# EAGLE design M5921A (EAGLE 6.6.0)
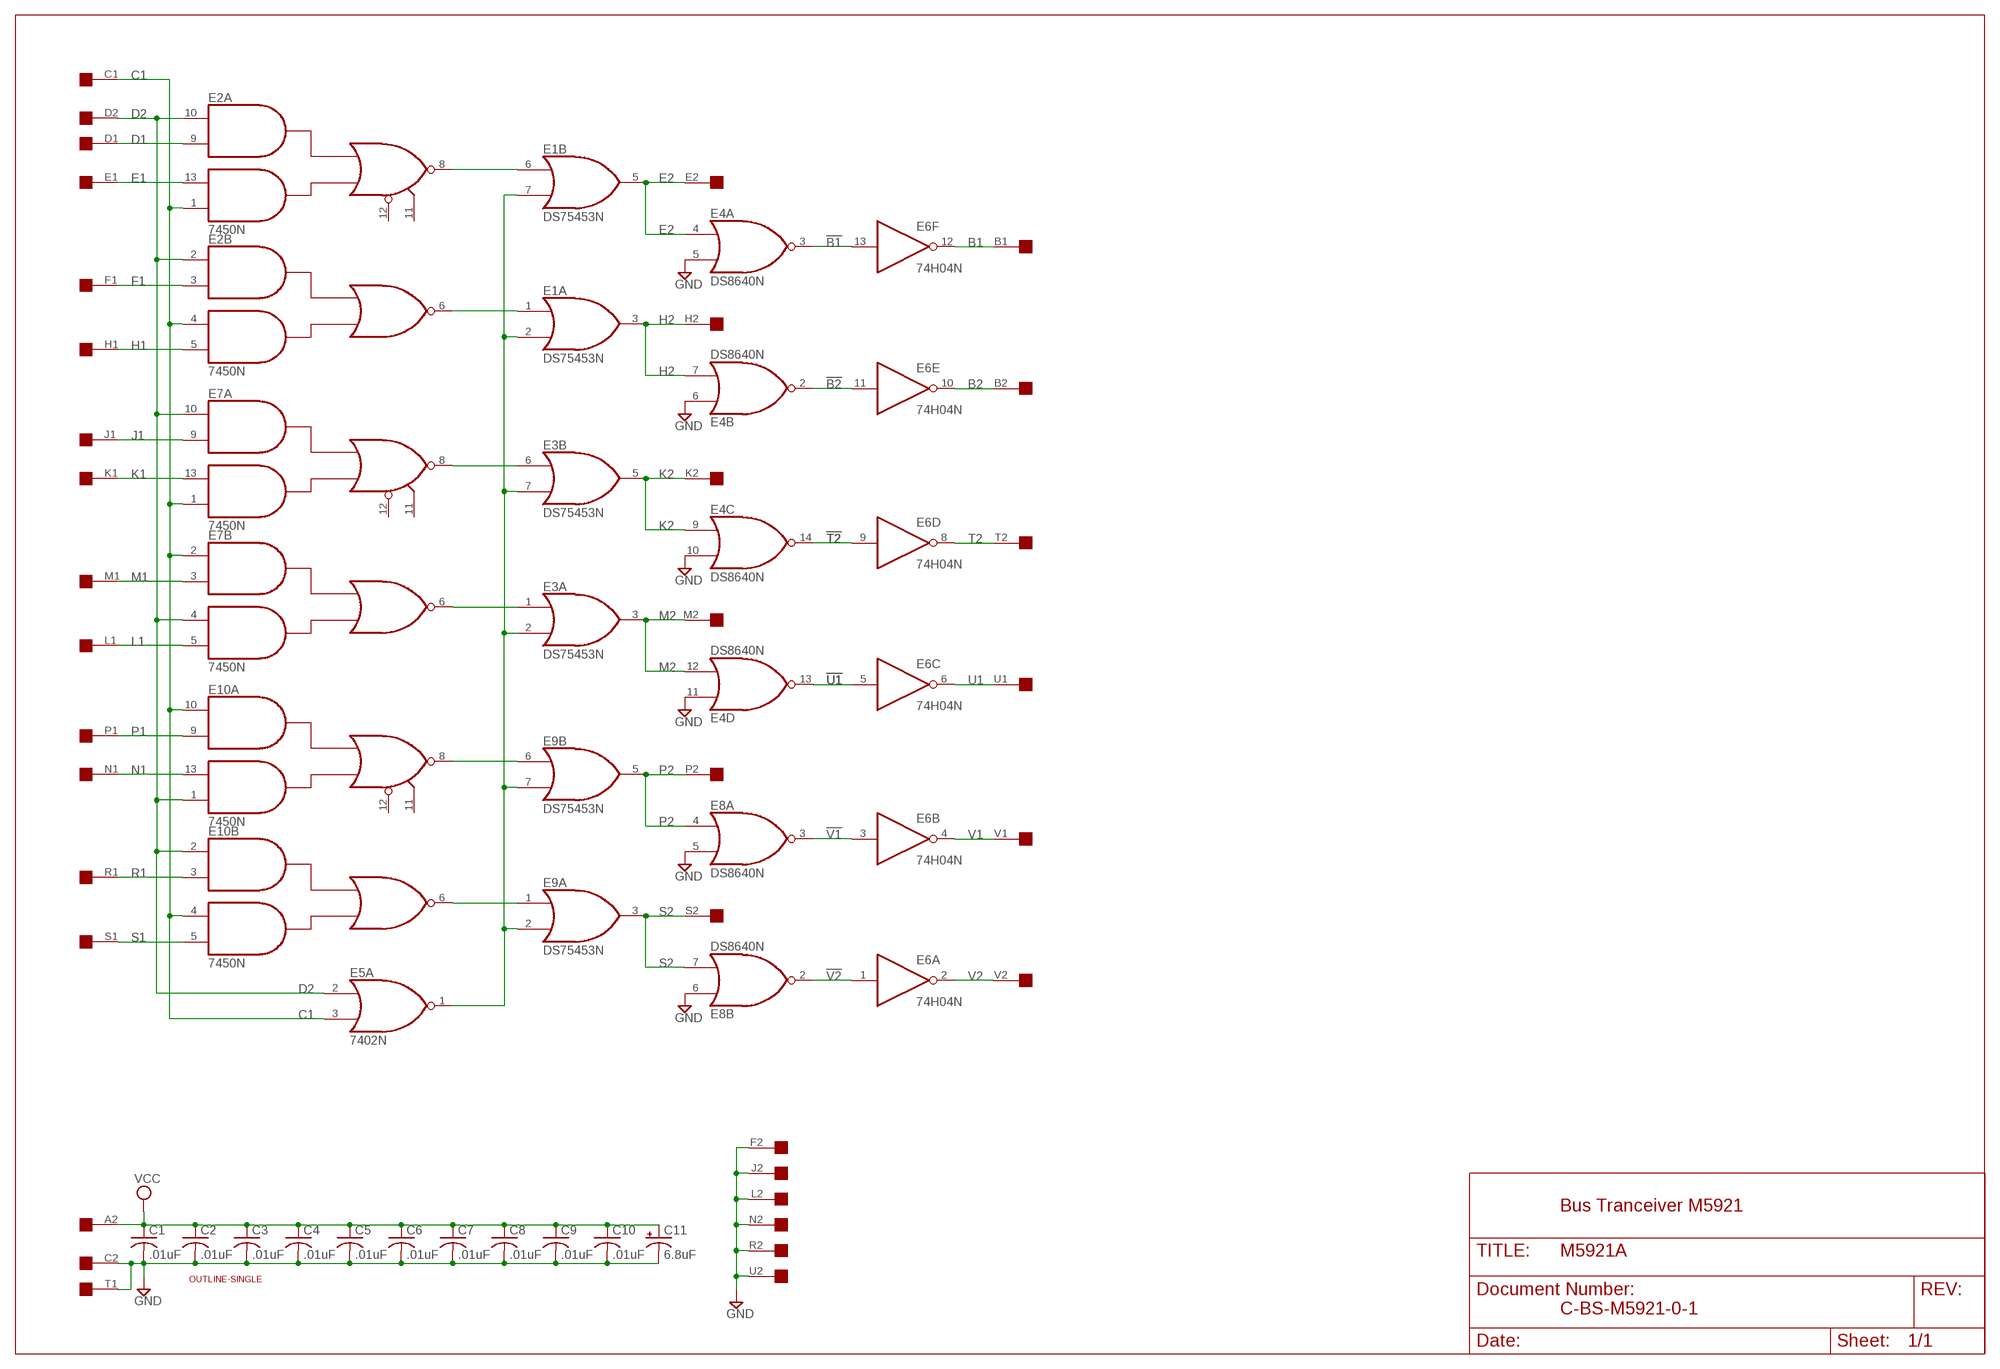
[diagram p0: schematic, sheet 1]

## Parts
C1  .01uF  C-US  [C063-025X075]
C2  .01uF  C-US  [C063-025X075]
C3  .01uF  C-US  [C063-025X075]
C4  .01uF  C-US  [C063-025X075]
C5  .01uF  C-US  [C063-025X075]
C6  .01uF  C-US  [C063-025X075]
C7  .01uF  C-US  [C063-025X075]
C8  .01uF  C-US  [C063-025X075]
C9  .01uF  C-US  [C063-025X075]
C10  .01uF  C-US  [C063-025X075]
C11  6.8uF  CPOL-USE15-5AXIAL  [E15-5]
E1  DS75453N  [DIL08]
E2  7450N  [DIL14]
E3  DS75453N  [DIL08]
E4  DS8640N  [DIL14]
E5  7402N  [DIL14]
E6  74H04N  74S04N  [DIL14]
E7  7450N  [DIL14]
E8  DS8640N  [DIL14]
E9  DS75453N  [DIL08]
E10  7450N  [DIL14]
U$1  OUTLINE-SINGLE  [SINGLE]
U$2  edge  SINGLE  [EDGE-CON2]

## Nets
!B1: E4.3(A:O) E6.13(F:I)
!B2: E4.2(B:O) E6.11(E:I)
!T2: E4.14(C:O) E6.9(D:I)
!U1: E4.13(D:O) E6.5(C:I)
!V1: E6.3(B:I) E8.3(A:O)
!V2: E6.1(A:I) E8.2(B:O)
B1: E6.12(F:O) U$2.B1
B2: E6.10(E:O) U$2.B2
C1: E2.1(A:I4) E2.4(B:I3) E5.3(A:I1) E7.1(A:I4) E7.2(B:I1) E10.4(B:I3) E10.10(A:I1) U$2.C1
D1: E2.9(A:I2) U$2.D1
D2: E2.2(B:I1) E2.10(A:I1) E5.2(A:I0) E7.4(B:I3) E7.10(A:I1) E10.1(A:I4) E10.2(B:I1) U$2.D2
E1: E2.13(A:I3) U$2.E1
E2: E1.5(B:O) E4.4(A:I0) U$2.E2
F1: E2.3(B:I2) U$2.F1
GND [supply]: C1.2 C2.2 C3.2 C4.2 C5.2 C6.2 C7.2 C8.2 C9.2 C10.2 C11.- E4.5(A:I1) E4.6(B:I0) E4.10(C:I1) E4.11(D:I0) E8.5(A:I1) E8.6(B:I0) U$2.C2 U$2.F2 U$2.J2 U$2.L2 U$2.N2 U$2.R2 U$2.T1 U$2.U2
H1: E2.5(B:I4) U$2.H1
H2: E1.3(A:O) E4.7(B:I1) U$2.H2
J1: E7.9(A:I2) U$2.J1
K1: E7.13(A:I3) U$2.K1
K2: E3.5(B:O) E4.9(C:I0) U$2.K2
L1: E7.5(B:I4) U$2.L1
M1: E7.3(B:I2) U$2.M1
M2: E3.3(A:O) E4.12(D:I1) U$2.M2
N1: E10.13(A:I3) U$2.N1
N$13: E1.1(A:I0) E2.6(B:O)
N$14: E1.6(B:I0) E2.8(A:O)
N$15: E1.2(A:I1) E1.7(B:I1) E3.2(A:I1) E3.7(B:I1) E5.1(A:O) E9.2(A:I1) E9.7(B:I1)
N$18: E3.6(B:I0) E7.8(A:O)
N$20: E3.1(A:I0) E7.6(B:O)
N$25: E9.6(B:I0) E10.8(A:O)
N$27: E9.1(A:I0) E10.6(B:O)
P1: E10.9(A:I2) U$2.P1
P2: E8.4(A:I0) E9.5(B:O) U$2.P2
R1: E10.3(B:I2) U$2.R1
S1: E10.5(B:I4) U$2.S1
S2: E8.7(B:I1) E9.3(A:O) U$2.S2
T2: E6.8(D:O) U$2.T2
U1: E6.6(C:O) U$2.U1
V1: E6.4(B:O) U$2.V1
V2: E6.2(A:O) U$2.V2
VCC [supply]: C1.1 C2.1 C3.1 C4.1 C5.1 C6.1 C7.1 C8.1 C9.1 C10.1 C11.+ U$2.A2
Unconnected: E2.11(A:I6) E2.12(A:I5) E5.4(B:O) E5.5(B:I0) E5.6(B:I1) E5.8(C:I0) E5.9(C:I1) E5.10(C:O) E5.11(D:I0) E5.12(D:I1) E5.13(D:O) E7.11(A:I6) E7.12(A:I5) E8.9(C:I0) E8.10(C:I1) E8.11(D:I0) E8.12(D:I1) E8.13(D:O) E8.14(C:O) E10.11(A:I6) E10.12(A:I5) U$2.A1

## Notes on the sheet
- Bus Tranceiver M5921
- C-BS-M5921-0-1

## Power pins joined to a net without a drawn wire
GND: E1.4(P:GND) E2.7(P:GND) E3.4(P:GND) E4.1(P:GND) E5.7(P:GND) E6.7(P:GND) E7.7(P:GND) E8.1(P:GND) E9.4(P:GND) E10.7(P:GND)
VCC: E1.8(P:VCC) E2.14(P:VCC) E3.8(P:VCC) E4.8(P:VCC) E5.14(P:VCC) E6.14(P:VCC) E7.14(P:VCC) E8.8(P:VCC) E9.8(P:VCC) E10.14(P:VCC)

## Library data of the parts
C1-C10 = dec-con:C-US: Capacitor with funky DEC lead spacing.
C11 = dec-con:CPOL-USE15-5AXIAL: 0.6" veresion of an electrolytic
E1 E3 E9 = dec-con:DS75453: Quad 2-input OR gate, open collector output
E2 E7 E10 = dec-con:74*50: 4-2-3-2 input AND OR INVERTER gates
E4 E8 = dec-con:DS8640: Quad NOR gate
E5 = 74xx-us:74*02: Quad 2-input NOR gate
E6 = 74xx-us:74*04: Hex INVERTER
U$1 = dec-con:OUTLINE-*: Board outlines for DEC boards.
U$2 = dec-con:SINGLE: Single-Height DEC board

## Net classes
1 supply: width 0.813 mm

## Board
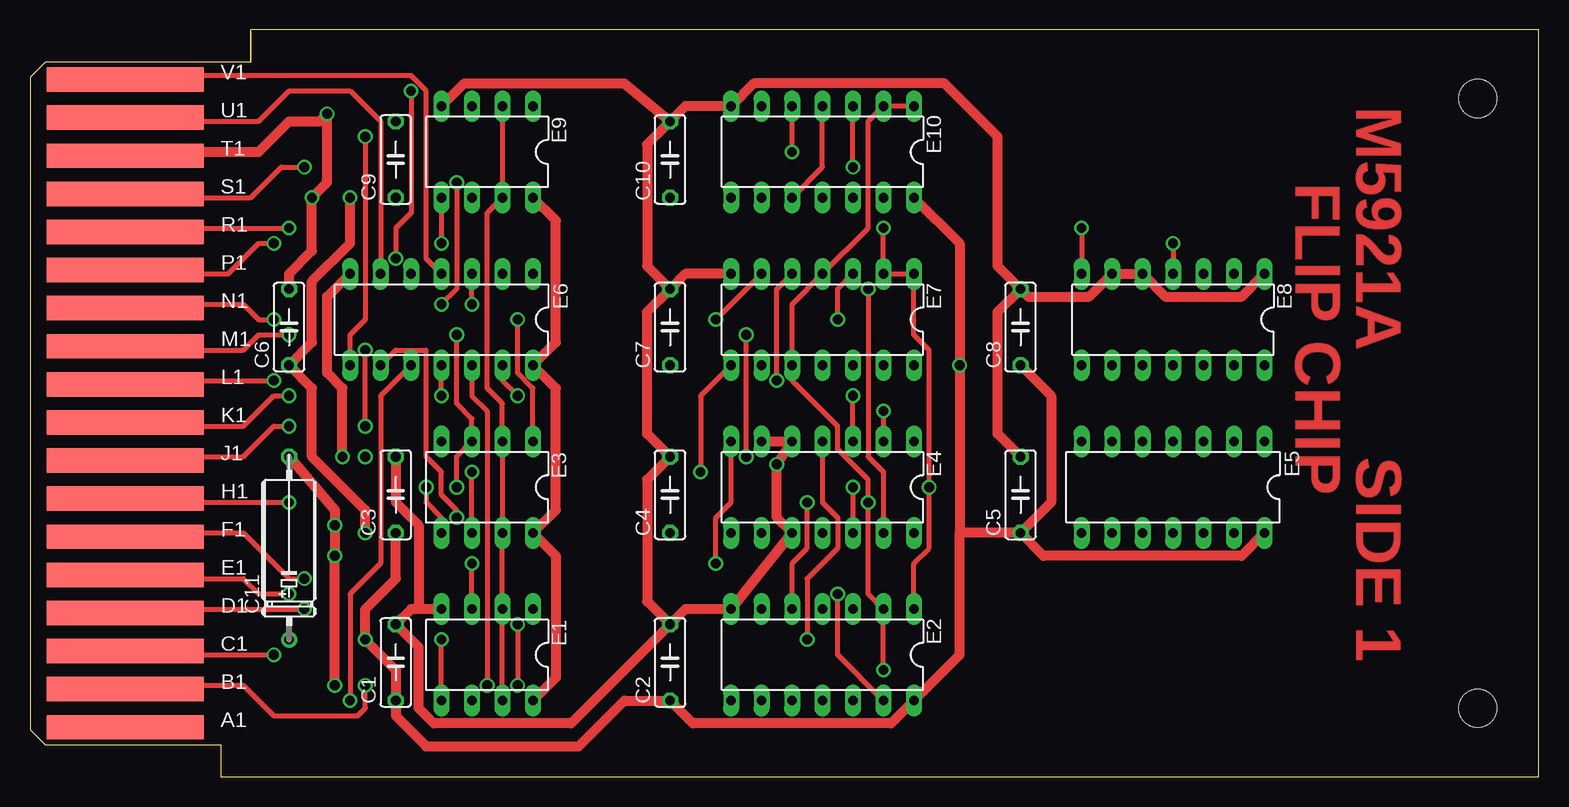
[diagram p1: board, top side]
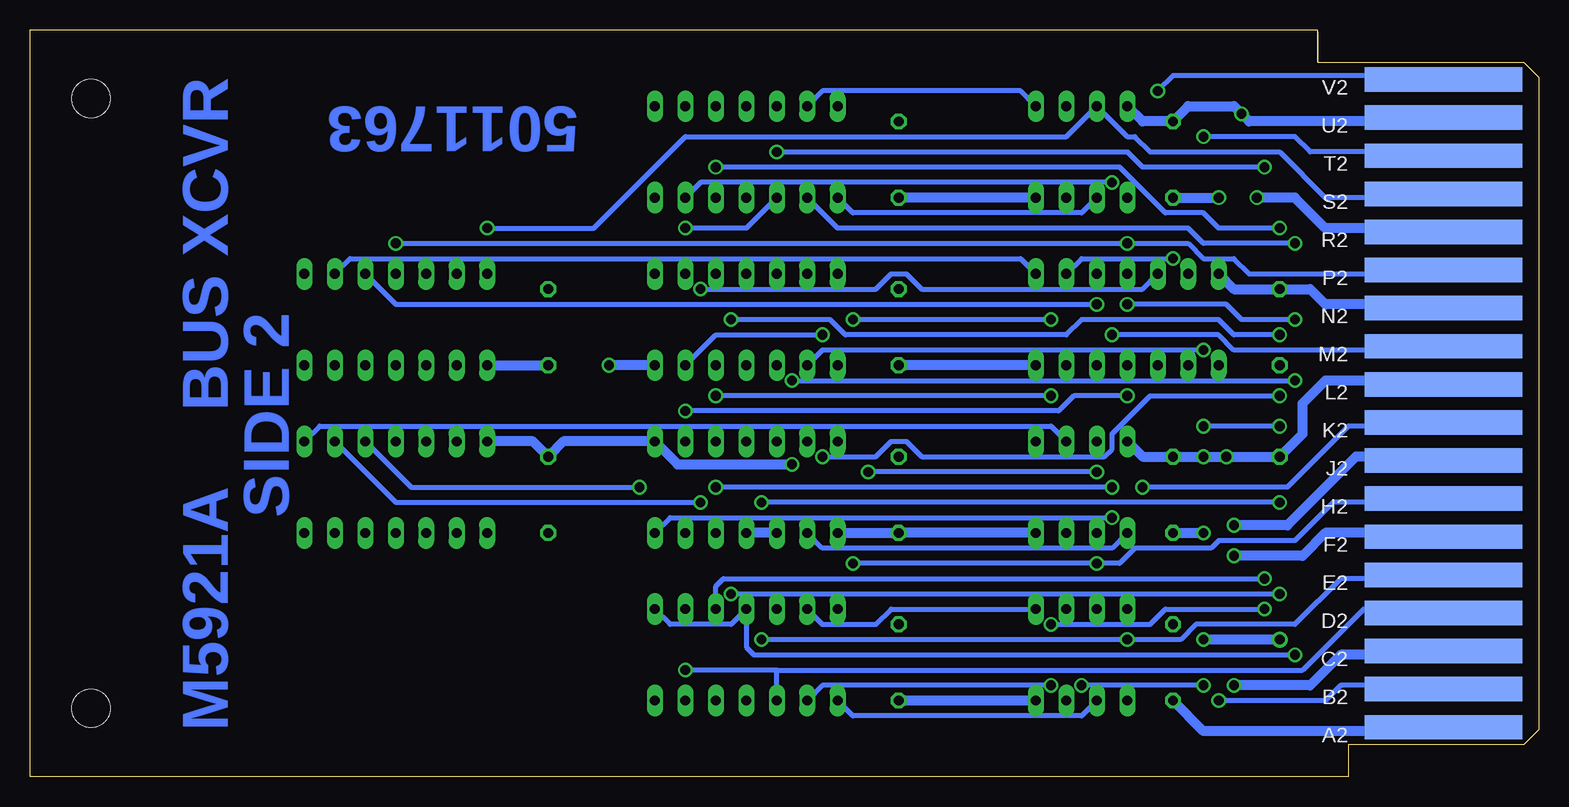
[diagram p2: board, bottom side, seen from below]

Size 125.73 x 62.23 mm. Coordinates in mm from the lower left corner, seen from the top.
Copper layers (1+16): Top 0.035mm / dielectric 1.5mm / Bottom 0.035mm
Design rules "16mils": minimum track width 16mil, minimum drill 32mil, track to track 15mil, track to pad 10mil, pad to pad 10mil, via to via 10mil, smd to smd 10mil, copper to edge 13mil, drill to drill 10mil, minimum pad ring 10mil, minimum via ring 8mil, stop-mask expansion 0mil, vias tented up to drill 0mil, thermal gap 10mil

### Footprints (pad centres in the part's own frame; a part is rotated, then mirrored left to right if it is on the bottom)
C063-025X075 = drill 0.813 octagon: 1 -2.54,0; 2 3.81,0
E15-5 = drill 0.813: + -7.62,0 | drill 0.813 octagon: - 7.62,0
DIL08 = drill 0.813 long: 1 -3.81,-3.81; 2 -1.27,-3.81; 3 1.27,-3.81; 4 3.81,-3.81; 5 3.81,3.81; 6 1.27,3.81; 7 -1.27,3.81; 8 -3.81,3.81
DIL14 = drill 0.813 long: 1 -7.62,-3.81; 2 -5.08,-3.81; 3 -2.54,-3.81; 4 0,-3.81; 5 2.54,-3.81; 6 5.08,-3.81; 7 7.62,-3.81; 8 7.62,3.81; 9 5.08,3.81; 10 2.54,3.81; 11 0,3.81; 12 -2.54,3.81; 13 -5.08,3.81; 14 -7.62,3.81
SINGLE = hole 3.175: 120.65,56.515; 120.65,5.715
EDGE-CON2 = smd 13.106 x 2.032: A1 7.938,4.128; B1 7.938,7.303; C1 7.938,10.477; D1 7.938,13.652; E1 7.938,16.828; F1 7.938,20.003; H1 7.938,23.177; J1 7.938,26.352; K1 7.938,29.527; L1 7.938,32.703; M1 7.938,35.877; N1 7.938,39.053; P1 7.938,42.227; R1 7.938,45.403; S1 7.938,48.578; T1 7.938,51.752; U1 7.938,54.928; V1 7.938,58.102 | smd 13.106 x 2.032 bottom: A2 7.938,4.128; B2 7.938,7.303; C2 7.938,10.477; D2 7.938,13.652; E2 7.938,16.828; F2 7.938,20.003; H2 7.938,23.177; J2 7.938,26.352; K2 7.938,29.527; L2 7.938,32.703; M2 7.938,35.877; N2 7.938,39.053; P2 7.938,42.227; R2 7.938,45.403; S2 7.938,48.578; T2 7.938,51.752; U2 7.938,54.928; V2 7.938,58.102

### Placement (x,y rotation side)
C1  30.48,8.89 90 top
C2  53.34,8.89 90 top
C3  30.48,22.86 90 top
C4  53.34,22.86 90 top
C5  82.55,22.86 90 top
C6  21.59,36.83 90 top
C7  53.34,36.83 90 top
C8  82.55,36.83 90 top
C9  30.48,50.8 90 top
C10  53.34,50.8 90 top
C11  21.59,19.05 90 top
E1  38.1,10.16 180 top
E2  66.04,10.16 180 top
E3  38.1,24.13 180 top
E4  66.04,24.13 180 top
E5  95.25,24.13 180 top
E6  34.29,38.1 180 top
E7  66.04,38.1 180 top
E8  95.25,38.1 180 top
E9  38.1,52.07 180 top
E10  66.04,52.07 180 top
U$1  0,0 0 top
U$2  0,0 0 top

### Tracks (layer width: path | path; a pad name or v marks a point on that pad's centre or on a via)
!B1  (via drill 0.81)
  Top 0.406: v40.64,31.75 39.37,33.02 E6.13 | E4.3 v68.58,31.75
  Bottom 0.406: v40.64,31.75 v68.58,31.75
!B2  (via drill 0.81)
  Top 0.406: v34.29,31.75 E6.11 | v71.12,30.48 E4.2
  Bottom 0.406: v34.29,31.75 38.74,31.75 40.01,30.48 v71.12,30.48
!T2  (via drill 0.81)
  Top 0.406: v35.56,21.59 35.56,22.23 34.29,23.5 34.29,25.4 33.02,26.67 33.02,35.56 30.48,35.56 E6.9
  Bottom 0.406: E4.14 72.39,21.59 v35.56,21.59
!U1  (via drill 0.81)
  Top 0.406: v69.85,40.64 69.85,26.67 71.12,25.4 E4.13
  Bottom 0.406: v69.85,40.64 55.25,40.64 53.98,41.91 52.71,41.91 51.44,40.64 33.02,40.64 E6.5
!V1  (via drill 0.81)
  Top 0.406: v36.83,39.37 E6.3
  Bottom 0.406: E8.3 95.25,39.37 v36.83,39.37
!V2
  Bottom 0.406: E6.1 43.18,43.18 99.06,43.18 E8.2
B1  (via drill 0.81)
  Top 0.406: U$2.B1 8.57,7.3 8.89,7.62 17.78,7.62 20.32,5.08 27.31,5.08 27.94,5.71 v27.94,7.62 | v38.1,7.62 38.1,30.48 36.83,31.75 E6.12
  Bottom 0.406: v27.94,7.62 v38.1,7.62
B2  (via drill 0.81)
  Top 0.406: E6.10 29.21,31.75 29.21,17.78 26.67,15.24 v26.67,6.35
  Bottom 0.406: U$2.B2 8.57,7.3 8.89,7.62 16.51,7.62 17.78,6.35 v26.67,6.35
C1  (via drill 0.81)
  Top 0.406: U$2.C1 8.57,10.48 8.89,10.16 v20.32,10.16 | E2.1 73.66,17.78 74.93,19.05 v74.93,24.13 74.93,35.56 73.66,36.83 E7.1 E7.2 v71.12,45.72 | E10.10 66.04,50.8 E10.4
  Bottom 0.406: E2.1 72.39,12.7 67.31,12.7 E2.4 66.04,10.79 65.41,10.16 v20.32,10.16 | E5.3 93.98,24.13 v74.93,24.13 | E10.10 66.04,45.72 v71.12,45.72
D1  (via drill 0.81)
  Top 0.406: U$2.D1 8.89,13.97 v22.86,13.97 | v40.64,12.7 v40.64,7.62
  Bottom 0.406: v40.64,12.7 32.39,12.7 31.12,13.97 v22.86,13.97 | v40.64,7.62 59.69,7.62 E2.9
D2  (via drill 0.81)
  Top 0.406: v71.12,8.89 E2.2 69.85,15.24 v69.85,22.86 69.85,24.77 67.31,27.3 67.31,29.21 63.5,33.02 E7.10 63.5,39.37 E7.4 69.85,45.72 69.85,54.61 E10.2 E10.1
  Bottom 0.406: U$2.D2 8.57,13.65 8.89,13.97 14.61,13.97 19.69,8.89 63.5,8.89 | E2.10 63.5,8.89 | 63.5,8.89 v71.12,8.89 | E5.2 95.25,22.86 v69.85,22.86
E1  (via drill 0.81)
  Top 0.406: U$2.E1 8.89,16.51 17.78,16.51 19.05,15.24 v21.59,15.24 | E2.13 67.31,10.16 v67.31,15.24
  Bottom 0.406: v67.31,15.24 v21.59,15.24
E2  (via drill 0.81)
  Top 0.406: v64.77,11.43 64.77,16.51 67.31,19.05 67.31,21.59 66.04,22.86 E4.4 | E1.5 v34.29,11.43
  Bottom 0.406: U$2.E2 8.57,16.83 8.89,16.51 16.51,16.51 20.32,12.7 28.58,12.7 29.85,11.43 v34.29,11.43 v64.77,11.43
F1  (via drill 0.81)
  Top 0.406: U$2.F1 8.89,20.32 17.78,20.32 21.59,16.51 v22.86,16.51
  Bottom 0.406: E2.3 68.58,15.88 67.95,16.51 v22.86,16.51
GND  (via drill 0.81)
  Top 0.813: v25.4,7.62 v25.4,18.41 v25.4,20.95 25.4,22.23 C11.- | E1.4 32.39,13.97 | 32.39,13.97 31.75,13.97 C1.2 32.39,10.79 32.39,5.71 33.66,4.45 45.09,4.45 C2.2 | C3.2 30.48,22.86 32.39,20.95 32.39,13.97 | v26.04,26.67 26.04,32.38 24.77,33.66 24.77,40.01 E6.7 | C6.2 21.59,41.91 23.5,43.81 v23.5,48.26 24.77,49.53 v24.77,55.24 24.13,54.61 21.59,54.61 19.05,52.07 8.89,52.07 8.57,51.75 U$2.T1 | C2.2 54.61,13.97 E2.7 E4.10 62.23,21.59 v62.23,26.04 E4.5 E4.6 | C2.2 51.44,14.61 51.44,24.77 C4.2 51.44,28.57 51.44,38.73 C7.2 | E7.7 54.61,41.91 C7.2 | C10.2 51.44,52.7 51.44,42.55 C7.2 | C10.2 54.61,55.88 E10.7 60.33,57.78 76.2,57.78 80.65,53.34 80.65,42.55 C8.2 | C5.2 80.65,28.57 80.65,38.73 C8.2 | C8.2 83.19,40.01 88.27,40.01 E8.6 E8.5 94.62,40.01 100.97,40.01 E8.1 | E9.4 36.2,57.78 49.53,57.78 C10.2
  Bottom 0.813: E3.4 33.02,26.67 C3.2 v27.94,26.67 v26.04,26.67 C11.- 19.69,28.57 19.69,31.11 17.78,33.02 8.89,33.02 8.57,32.7 U$2.L2 | U$2.C2 8.57,10.48 8.89,10.16 16.51,10.16 19.05,7.62 v25.4,7.62 | U$2.F2 8.57,20 8.89,20.32 17.78,20.32 19.69,18.41 v25.4,18.41 | U$2.J2 8.57,26.35 8.89,26.67 15.24,26.67 20.96,20.95 v25.4,20.95 | v62.23,26.04 71.76,26.04 E4.1 81.28,27.94 C5.2 83.82,27.94 E5.7 | U$2.N2 8.57,39.05 8.89,39.37 17.78,39.37 19.05,40.64 C6.2 25.4,40.64 E6.7 | U$2.U2 8.57,54.93 8.89,54.61 24.13,54.61 v24.77,55.24 25.4,55.88 29.21,55.88 C9.2 33.02,54.61 E9.4 | U$2.R2 8.57,45.4 8.89,45.72 17.78,45.72 20.32,48.26 v23.5,48.26 | E4.10 E4.11
H1  (via drill 0.81)
  Top 0.406: U$2.H1 8.89,22.86 v21.59,22.86 | E2.5 63.5,17.78 64.77,19.05 v64.77,22.86
  Bottom 0.406: v21.59,22.86 v64.77,22.86
H2  (via drill 0.81)
  Top 0.406: E1.3 v36.83,17.78 | v57.15,17.78 57.15,21.59 58.42,22.86 E4.7
  Bottom 0.406: U$2.H2 8.57,23.18 8.89,22.86 17.15,22.86 20.32,19.68 26.67,19.68 27.31,19.05 33.66,19.05 34.93,17.78 v36.83,17.78 v57.15,17.78
J1  (via drill 0.81)
  Top 0.406: v27.94,29.21 v27.94,35.56 | U$2.J1 8.89,26.67 17.78,26.67 20.32,29.21 v21.59,29.21
  Bottom 0.406: v27.94,35.56 59.69,35.56 E7.9 | v21.59,29.21 v27.94,29.21
K1  (via drill 0.81)
  Top 0.406: U$2.K1 8.89,29.21 17.78,29.21 20.32,31.75 v21.59,31.75 | v59.69,26.67 v59.69,36.83
  Bottom 0.406: v59.69,26.67 55.25,26.67 53.98,27.94 52.71,27.94 51.44,26.67 36.2,26.67 35.56,27.3 35.56,28.57 32.39,31.75 v21.59,31.75 | E7.13 68.58,36.83 v59.69,36.83
K2  (via drill 0.81)
  Top 0.406: v33.02,24.13 33.02,22.86 34.29,21.59 E3.5
  Bottom 0.406: v33.02,24.13 20.96,24.13 15.88,29.21 8.89,29.21 8.57,29.53 U$2.K2 | E3.5 35.56,19.05 59.69,19.05 E4.9
L1  (via drill 0.81)
  Top 0.406: U$2.L1 8.89,33.02 v20.32,33.02 | v62.23,33.02 62.23,40.64 E7.5
  Bottom 0.406: v62.23,33.02 v20.32,33.02
M1  (via drill 0.81)
  Top 0.406: U$2.M1 8.89,35.56 17.78,35.56 19.05,36.83 v21.59,36.83 | v67.31,38.1 67.31,40.64 E7.3
  Bottom 0.406: v21.59,36.83 25.4,36.83 26.67,38.1 38.1,38.1 39.37,36.83 57.79,36.83 59.06,38.1 v67.31,38.1
M2  (via drill 0.81)
  Top 0.406: v35.56,36.83 35.56,31.11 36.83,29.84 E3.3 35.56,26.67 v35.56,24.13 | v68.58,24.13 E4.12
  Bottom 0.406: U$2.M2 8.57,35.88 8.89,35.56 25.4,35.56 26.67,36.83 v35.56,36.83 | v35.56,24.13 v68.58,24.13
N1  (via drill 0.81)
  Top 0.406: U$2.N1 8.89,39.37 17.78,39.37 19.05,38.1 v20.32,38.1 | v35.56,49.53 35.56,40.64 v34.29,39.37
  Bottom 0.406: v20.32,38.1 24.77,38.1 26.04,39.37 v34.29,39.37 | v35.56,49.53 69.85,49.53 E10.13
N$13
  Bottom 0.406: E2.6 59.69,12.7 55.25,12.7 53.98,13.97 E1.1
N$14
  Bottom 0.406: E1.6 38.1,5.08 57.15,5.08 E2.8
N$15
  Top 0.406: E1.7 E1.2 E3.7 E3.2 39.37,31.11 38.1,32.38 38.1,46.99 E9.7 E9.2
  Bottom 0.406: E5.1 101.6,29.21 40.64,29.21 E3.2
N$18  (via drill 0.81)
  Top 0.406: E7.8 55.88,31.75 v55.88,25.4 | E3.6 v36.83,25.4
  Bottom 0.406: v36.83,25.4 v55.88,25.4
N$20  (via drill 0.81)
  Top 0.406: E3.1 41.91,32.38 40.64,33.66 v40.64,38.1 | v57.15,38.1 E7.6
  Bottom 0.406: v40.64,38.1 v57.15,38.1
N$25
  Bottom 0.406: E9.6 38.1,46.99 57.15,46.99 E10.8
N$27
  Bottom 0.406: E9.1 43.18,57.15 59.69,57.15 E10.6
P1  (via drill 0.81)
  Top 0.406: U$2.P1 8.89,41.91 16.51,41.91 19.05,44.45 v20.32,44.45
  Bottom 0.406: v20.32,44.45 27.94,44.45 29.21,45.72 58.42,45.72 E10.9
P2  (via drill 0.81)
  Top 0.406: v95.25,44.45 E8.4 | E9.5 v34.29,44.45
  Bottom 0.406: v95.25,44.45 v34.29,44.45 29.21,44.45 27.94,43.18 25.4,43.18 24.13,41.91 8.89,41.91 8.57,42.23 U$2.P2
R1  (via drill 0.81)
  Top 0.406: U$2.R1 8.89,45.72 v21.59,45.72 | v68.58,50.8 E10.3
  Bottom 0.406: v21.59,45.72 26.67,45.72 27.94,46.99 31.12,46.99 34.93,50.8 v68.58,50.8
S1  (via drill 0.81)
  Top 0.406: U$2.S1 8.89,48.26 18.42,48.26 20.96,50.8 v22.86,50.8 | v63.5,52.07 E10.5
  Bottom 0.406: v22.86,50.8 33.02,50.8 34.29,52.07 v63.5,52.07
S2  (via drill 0.81)
  Top 0.406: v87.63,45.72 E8.7
  Bottom 0.406: v87.63,45.72 78.74,45.72 71.12,53.34 39.37,53.34 E9.3 34.29,53.34 33.66,53.34 32.39,52.07 21.59,52.07 17.78,48.26 8.89,48.26 8.57,48.58 U$2.S2
T2  (via drill 0.81)
  Top 0.406: v27.94,53.34 27.94,38.1 26.67,36.83 E6.8
  Bottom 0.406: U$2.T2 8.57,51.75 8.89,52.07 19.05,52.07 20.32,53.34 v27.94,53.34
U1
  Top 0.406: U$2.U1 8.89,54.61 19.05,54.61 21.59,57.15 26.67,57.15 29.21,54.61 E6.6
V1
  Top 0.406: E6.4 33.02,43.18 33.02,57.15 31.75,58.42 8.89,58.42 U$2.V1
V2  (via drill 0.81)
  Top 0.406: v31.75,57.15 31.75,46.99 30.48,45.72 v30.48,43.18
  Bottom 0.406: U$2.V2 8.57,58.1 8.89,58.42 30.48,58.42 v31.75,57.15 | E6.2 38.1,43.18 v30.48,43.18
VCC  (via drill 0.81)
  Top 0.813: C3.1 30.48,16.51 27.94,13.97 v27.94,11.43 30.48,8.89 C1.1 30.48,5.08 33.02,2.54 45.72,2.54 49.53,6.35 C2.1 55.25,4.45 71.76,4.45 E2.14 77.47,10.16 77.47,20.32 | v27.94,20.32 27.94,22.23 23.5,26.67 23.5,32.38 C6.1 23.5,36.2 23.5,41.27 26.67,44.45 v26.67,48.26 | C8.1 85.09,31.75 85.09,22.86 C5.1 | E5.14 100.97,18.41 84.46,18.41 C5.1 | C5.1 77.47,20.32 | 77.47,20.32 v77.47,34.29 77.47,44.45 E10.14 | E1.8 43.82,8.26 43.82,18.41 E3.8 43.82,22.23 43.82,32.38 E6.14 43.82,36.2 43.82,46.35 E9.8
  Bottom 0.813: C11.+ v27.94,11.43 | U$2.A2 8.57,4.13 8.89,3.81 27.94,3.81 C1.1 | E1.8 C2.1 | E3.8 C4.1 E4.8 | C3.1 v27.94,20.32 | E7.14 v77.47,34.29 | E8.8 C8.1 | E6.14 C7.1 | C9.1 v26.67,48.26 | E9.8 C10.1

### Text on the board
Top: M5921A | FLIP CHIP | SIDE 1
Bottom: 5011763 | BUS XCVR | SIDE 2 | M5921A